# Altium schematic sheet 按键模块.SchDoc
size A4; DocumentNumber: 5; SheetNumber: 5; SheetTotal: 8
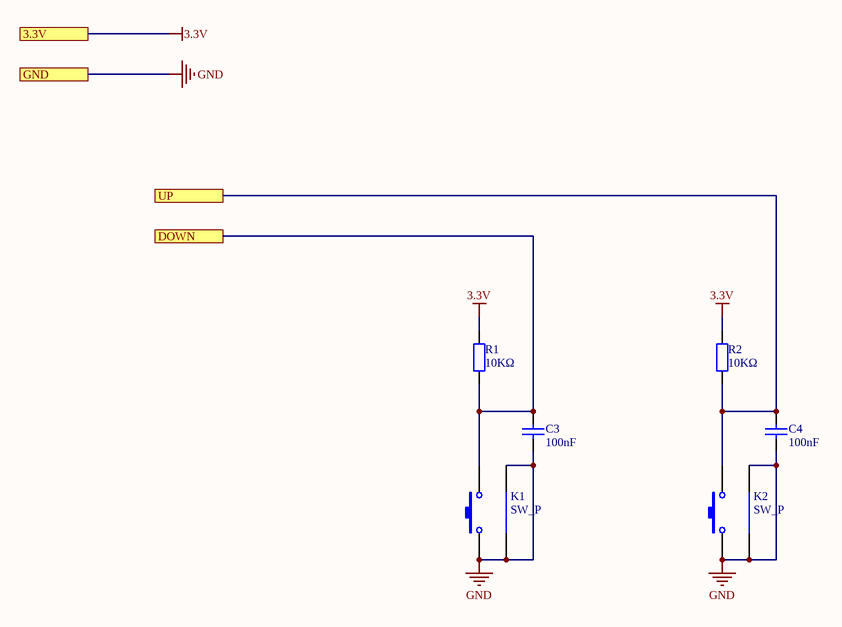
[diagram p0: 按键模块.SchDoc]

## Parts
C3  100nF  [LC-0603_C]
C4  100nF  [LC-0603_C]
K1  SW_P  [KEY-TH_K2-1112SA-AXXW-XX]
K2  SW_P  [KEY-TH_K2-1112SA-AXXW-XX]
R1  10KΩ  [LC-0603_R]
R2  10KΩ  [LC-0603_R]

## Ports
3.3V, DOWN, GND, UP

## Nets
3.3V: R1.2 R2.2 ; port 3.3V
GND: C3.1 C4.1 K1.1 K1.3 K1.4 K2.1 K2.3 K2.4 ; port GND
DOWN: C3.2 K1.2 R1.1 ; port DOWN
UP: C4.2 K2.2 R2.1 ; port UP

## Library data of the parts
C3 C4 = 0603 100nF (104) 10% 50V: 贴片电容; ComponentLink1Description: 供应商链接; ComponentLink1URL: http://www.szlcsc.com/product/details_15331.html; Package: 0603; Supplier: LC; SuppliersPartNumber: C14663
K1 K2 = SW_P: 轻触开关侧
R1 R2 = 0603 10KΩ (1002) 1%: 贴片电阻; ComponentLink1Description: 供应商链接; ComponentLink1URL: http://www.szlcsc.com/product/details_26547.html; Package: 0603; Supplier: LC; SuppliersPartNumber: C25804